# EAGLE design LED_Test_PIO_2 (EAGLE 9.6.2)
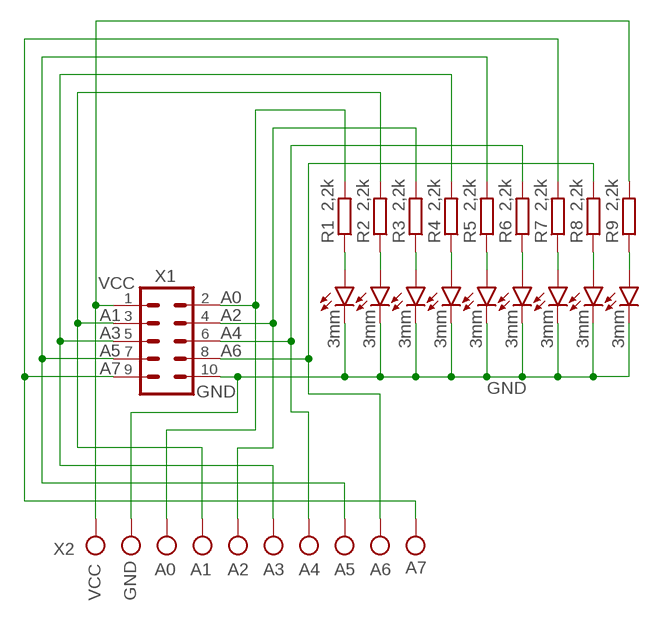
[diagram p0: schematic, sheet 1]

## Parts
LED1  3mm  LED3MM  [LED3MM]
LED2  3mm  LED3MM  [LED3MM]
LED3  3mm  LED3MM  [LED3MM]
LED4  3mm  LED3MM  [LED3MM]
LED5  3mm  LED3MM  [LED3MM]
LED6  3mm  LED3MM  [LED3MM]
LED7  3mm  LED3MM  [LED3MM]
LED8  3mm  LED3MM  [LED3MM]
LED9  3mm  LED3MM  [LED3MM]
R1  2,2k  R-EU_0207/10  [0207/10]
R2  2,2k  R-EU_0207/10  [0207/10]
R3  2,2k  R-EU_0207/10  [0207/10]
R4  2,2k  R-EU_0207/10  [0207/10]
R5  2,2k  R-EU_0207/10  [0207/10]
R6  2,2k  R-EU_0207/10  [0207/10]
R7  2,2k  R-EU_0207/10  [0207/10]
R8  2,2k  R-EU_0207/10  [0207/10]
R9  2,2k  R-EU_0207/10  [0207/10]
SV1  X1  ML10  [ML10]
X1  X2  W237-102  [W237-102]
X2  X2  W237-102  [W237-102]
X3  X2  W237-102  [W237-102]
X4  X2  W237-102  [W237-102]
X5  X2  W237-102  [W237-102]

## Nets
A0: R1.2 SV1.2 X2.1
A1: R2.2 SV1.3 X2.2
A2: R3.2 SV1.4 X3.1
A3: R4.2 SV1.5 X3.2
A4: R6.2 SV1.6 X4.1
A5: R5.2 SV1.7 X4.2
A6: R8.2 SV1.8 X5.1
A7: R7.2 SV1.9 X5.2
GND [power]: LED1.K(C) LED2.K(C) LED3.K(C) LED4.K(C) LED5.K(C) LED6.K(C) LED7.K(C) LED8.K(C) LED9.K(C) SV1.10 X1.2
N$1: LED1.A R1.1
N$3: LED2.A R2.1
N$4: LED3.A R3.1
N$5: LED4.A R4.1
N$6: LED5.A R5.1
N$7: LED6.A R6.1
N$8: LED7.A R7.1
N$9: LED8.A R8.1
N$18: LED9.A R9.1
VCC [power]: R9.2 SV1.1 X1.1

## Library data of the parts
LED1-LED9 = led:LED: LED OSRAM: - CHIPLED LG R971, LG N971, LY N971, LG Q971, LY Q971, LO R971, LY R971 LH N974, LH R974 LS Q976, LO Q976, LY Q976 LO Q996 - Hyper CHIPLED LW Q18S LB Q993, LB Q99A, LB R99A - SideLED LS A670, LO A670, LY A670, LG A670, LP A670 LB A673, LV A673, LT A673, LW A673 LH A674 LY A675 LS A676, LA A676, LO A676, LY A676, LW A676 LS A679, LY A679, LG A679 - Hyper Micro SIDELED® LS Y876, LA Y876, LO Y876, LY Y876 LT Y87S - SmartLED LW L88C, LW L88S LB L89C, LB L89S, LG L890 LS L89K, LO L89K, LY L89K LS L896, LA L896, LO L896, LY L896 - TOPLED LS T670, LO T670, LY T670, LG T670, LP T670 LSG T670, LSP T670, LSY T670, LOP T670, LYG T670 LG T671, LOG T671, LSG T671 LB T673, LV T673, LT T673, LW T673 LH T674 LS T676, LA T676, LO T676, LY T676, LB T676, LH T676, LSB T676, LW T676 LB T67C, LV T67C, LT T67C, LS T67K, LO T67K, LY T67K, LW E67C LS E67B, LA E67B, LO E67B, LY E67B, LB E67C, LV E67C, LT E67C LW T67C LS T679, LY T679, LG T679 LS T770, LO T770, LY T770, LG T770, LP T770 LB T773, LV T773, LT T773, LW T773 LH T774 LS E675, LA E675, LY E675, LS T675 LS T776, LA T776, LO T776, LY T776, LB T776 LHGB T686 LT T68C, LB T68C - Hyper Mini TOPLED® LB M676 - Mini TOPLED Santana® LG M470 LS M47K, LO M47K, LY M47K Source: http://www.osram.convergy.de LUXEON: - LUMILED® LXK2-PW12-R00, LXK2-PW12-S00, LXK2-PW14-U00, LXK2-PW14-V00 LXK2-PM12-R00, LXK2-PM12-S00, LXK2-PM14-U00 LXK2-PE12-Q00, LXK2-PE12-R00, LXK2-PE12-S00, LXK2-PE14-T00, LXK2-PE14-U00 LXK2-PB12-K00, LXK2-PB12-L00, LXK2-PB12-M00, LXK2-PB14-N00, LXK2-PB14-P00, LXK2-PB14-Q00 LXK2-PR12-L00, LXK2-PR12-M00, LXK2-PR14-Q00, LXK2-PR14-R00 LXK2-PD12-Q00, LXK2-PD12-R00, LXK2-PD12-S00 LXK2-PH12-R00, LXK2-PH12-S00 LXK2-PL12-P00, LXK2-PL12-Q00, LXK2-PL12-R00 Source: www.luxeon.com KINGBRIGHT: KA-3528ASYC Source: www.kingbright.com
R1-R9 = rcl:R-EU_: RESISTOR, European symbol; SPICEPREFIX: R
SV1 = con-ml:ML10: HARTING; OC_FARNELL: unknown; OC_NEWARK: unknown
X1-X5 = con-wago-500:W237-102: WAGO SCREW CLAMP; MPN: 237-102; OC_FARNELL: unknown; OC_NEWARK: 70K9898

## Net classes
0 default: width 0.254 mm, clearance 0.152 mm
1 power: width 0.406 mm, clearance 0.152 mm

## Board
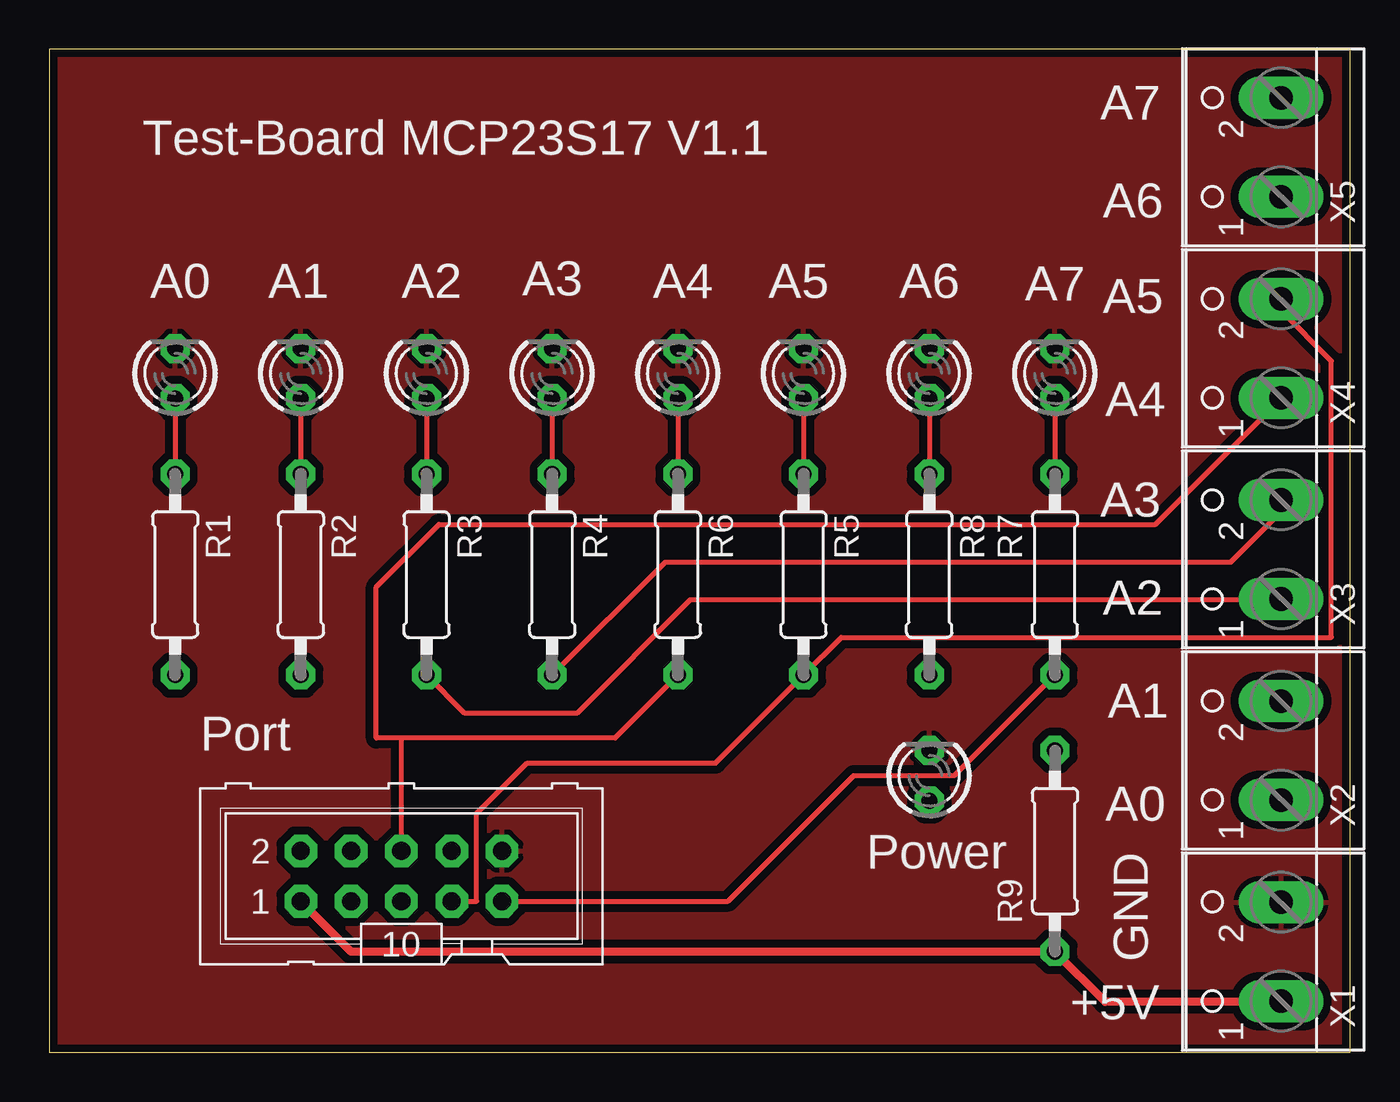
[diagram p1: board, top side]
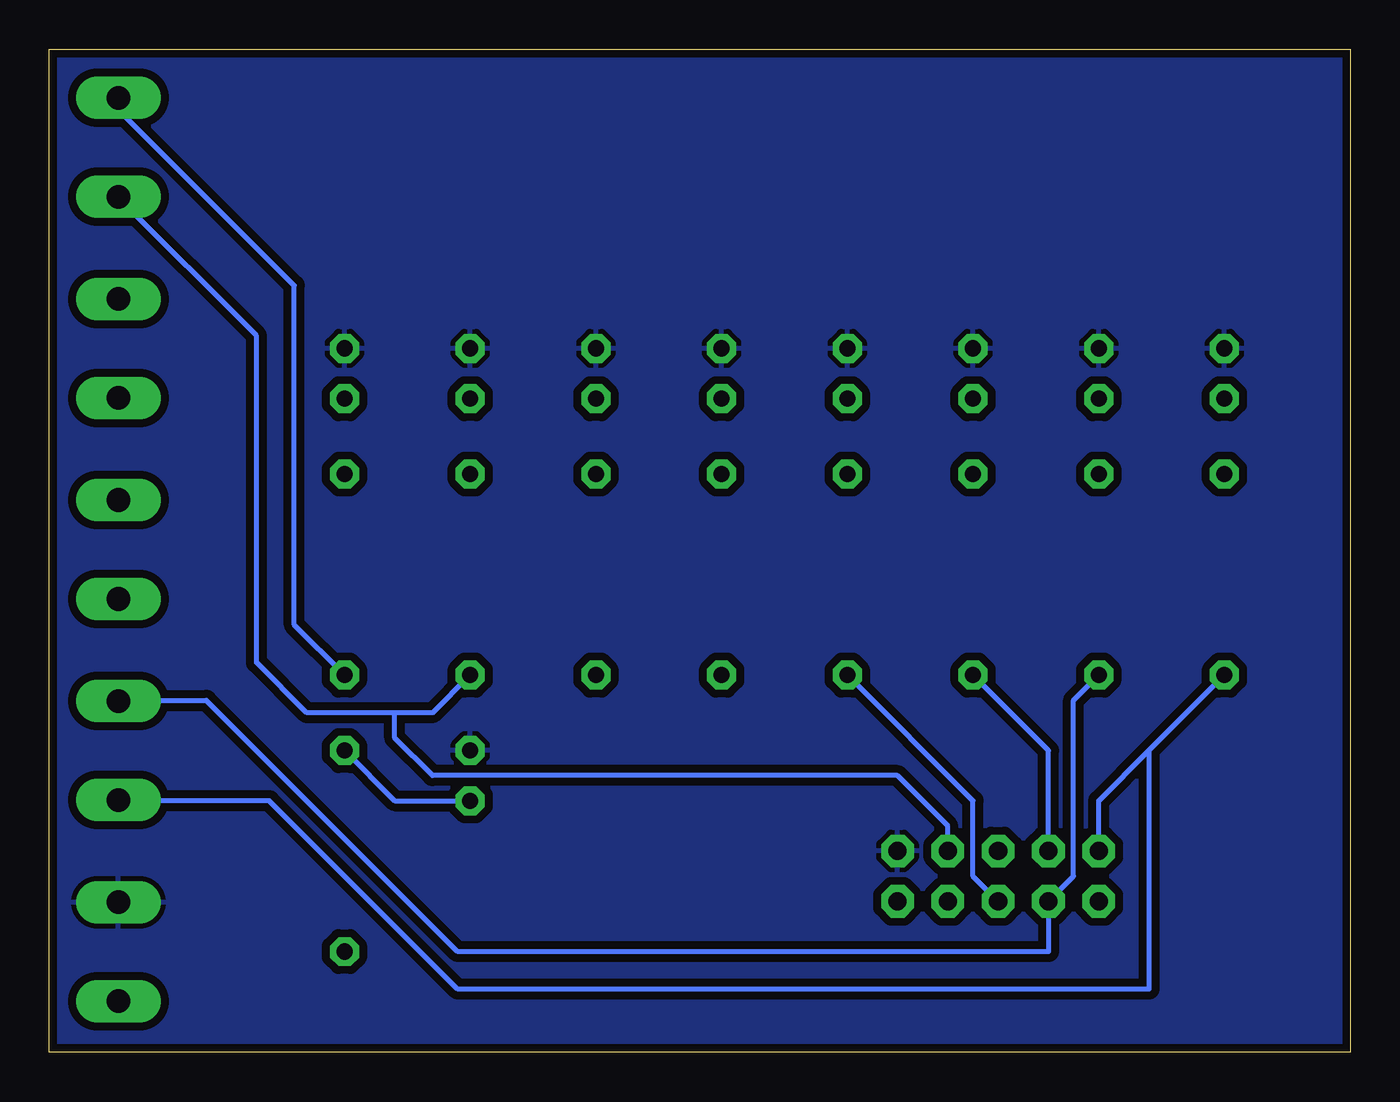
[diagram p2: board, bottom side, seen from below]

Size 65.71 x 50.66 mm. Coordinates in mm from the lower left corner, seen from the top.
Outline: 0,0 65.71,0 65.71,50.66 0,50.66 0,0
Copper layers (1*16): Top 0.035mm / dielectric 1.6mm / Bottom 0.035mm
Design rules "jlcpcb-2layers": minimum track width 5mil, minimum drill 0.3mm, track to track 5mil, track to pad 5mil, pad to pad 5mil, via to via 5mil, smd to smd 5mil, copper to edge 0.2mm, drill to drill 6mil, minimum pad ring 10mil, minimum via ring 3mil, stop-mask expansion 4mil, vias tented up to drill 0mil, thermal gap 10mil

### Footprints (pad centres in the part's own frame; a part is rotated, then mirrored left to right if it is on the bottom)
LED3MM = drill 0.813 octagon: A -1.27,0; K 1.27,0
0207/10 = drill 0.813 octagon: 1 -5.08,0; 2 5.08,0
ML10 = drill 0.914 octagon: 1 -5.08,-1.27; 2 -5.08,1.27; 3 -2.54,-1.27; 4 -2.54,1.27; 5 0,-1.27; 6 0,1.27; 7 2.54,-1.27; 8 2.54,1.27; 9 5.08,-1.27; 10 5.08,1.27
W237-102 = drill 1.194 long: 1 -2.5,-1.27; 2 2.5,-1.27

### Placement (x,y rotation side)
LED1  6.35,34.29 90 top
LED2  12.7,34.29 90 top
LED3  19.05,34.29 90 top
LED4  25.4,34.29 90 top
LED5  38.1,34.29 90 top
LED6  31.75,34.29 90 top
LED7  50.8,34.29 90 top
LED8  44.45,34.29 90 top
LED9  44.45,13.97 90 top
R1  6.35,24.13 270 top
R2  12.7,24.13 270 top
R3  19.05,24.13 270 top
R4  25.4,24.13 270 top
R5  38.1,24.13 270 top
R6  31.75,24.13 270 top
R7  50.8,24.13 270 top
R8  44.45,24.13 270 top
R9  50.8,10.16 270 top
SV1  17.78,8.89 0 top
X1  60.96,5.08 90 top
X2  60.96,15.24 90 top
X3  60.96,25.4 90 top
X4  60.96,35.56 90 top
X5  60.96,45.72 90 top

### Tracks (layer width: path | path; a pad name or v marks a point on that pad's centre or on a via)
A0
  Bottom 0.254: 10.16,15.24 12.7,12.7 SV1.2 | 10.16,15.24 R1.2 | 10.16,15.24 10.16,3.17 45.09,3.17 54.61,12.7 62.23,12.7 X2.1
A1
  Bottom 0.254: R2.2 13.97,17.78 13.97,8.89 SV1.3 15.24,5.08 45.09,5.08 57.78,17.78 62.19,17.78 X2.2
A2
  Top 0.254: R3.2 20.95,17.14 26.67,17.14 32.38,22.86 62.23,22.86 X3.1
  Bottom 0.254: R3.2 15.24,15.24 SV1.4
A3
  Top 0.254: R4.2 31.11,24.77 59.69,24.77 62.23,27.3 X3.2
  Bottom 0.254: R4.2 19.05,12.7 19.05,8.89 SV1.5
A4
  Top 0.254: R6.2 28.57,15.88 17.78,15.88 | SV1.6 17.78,15.88 | 17.78,15.88 16.51,15.88 16.51,23.5 19.68,26.67 55.88,26.67 62.23,33.02 X4.1
A5
  Top 0.254: SV1.7 21.59,7.62 21.59,12.06 24.13,14.61 33.66,14.61 R5.2 40.01,20.95 64.77,20.95 64.77,34.92 62.23,37.47 X4.2
A6
  Bottom 0.254: R8.2 46.35,17.14 48.26,17.14 | 48.26,17.14 48.26,15.88 46.35,13.97 22.86,13.97 20.32,11.43 SV1.8 | 48.26,17.14 52.7,17.14 55.24,19.68 55.24,36.2 62.23,43.18 X5.1
A7
  Top 0.254: R7.2 45.72,13.97 40.64,13.97 34.29,7.62 SV1.9
  Bottom 0.254: R7.2 53.34,21.59 53.34,38.73 62.23,47.62 X5.2
GND
  pour Top (isolate 0.406): 0,0 0,50.8 66.04,50.8 66.04,0
  pour Bottom (isolate 0.406): 0,0 0,50.8 66.04,50.8 66.04,0
N$1
  Top 0.254: LED1.A R1.1
N$3
  Top 0.254: LED2.A R2.1
N$4
  Top 0.254: LED3.A R3.1
N$5
  Top 0.254: LED4.A R4.1
N$6
  Top 0.254: LED5.A R5.1
N$7
  Top 0.254: LED6.A R6.1
N$8
  Top 0.254: LED7.A R7.1
N$9
  Top 0.254: LED8.A R8.1
N$18
  Bottom 0.254: LED9.A 48.26,12.7 R9.1
VCC
  Top 0.406: X1.1 62.19,2.54 53.34,2.54 R9.2 15.24,5.08 SV1.1

### Text on the board
tPlace: A7 | Test-Board MCP23S17 V1.1 | A6 | A0 | A1 | A2 | A3 | A4 | A5 | A6 | A7 | A5 | A4 | A3 | A2 | A1 | Port | A0 | Power | GND | +5V